# Altium project M1-Test-Board.PrjPcb (part 1 of 2)
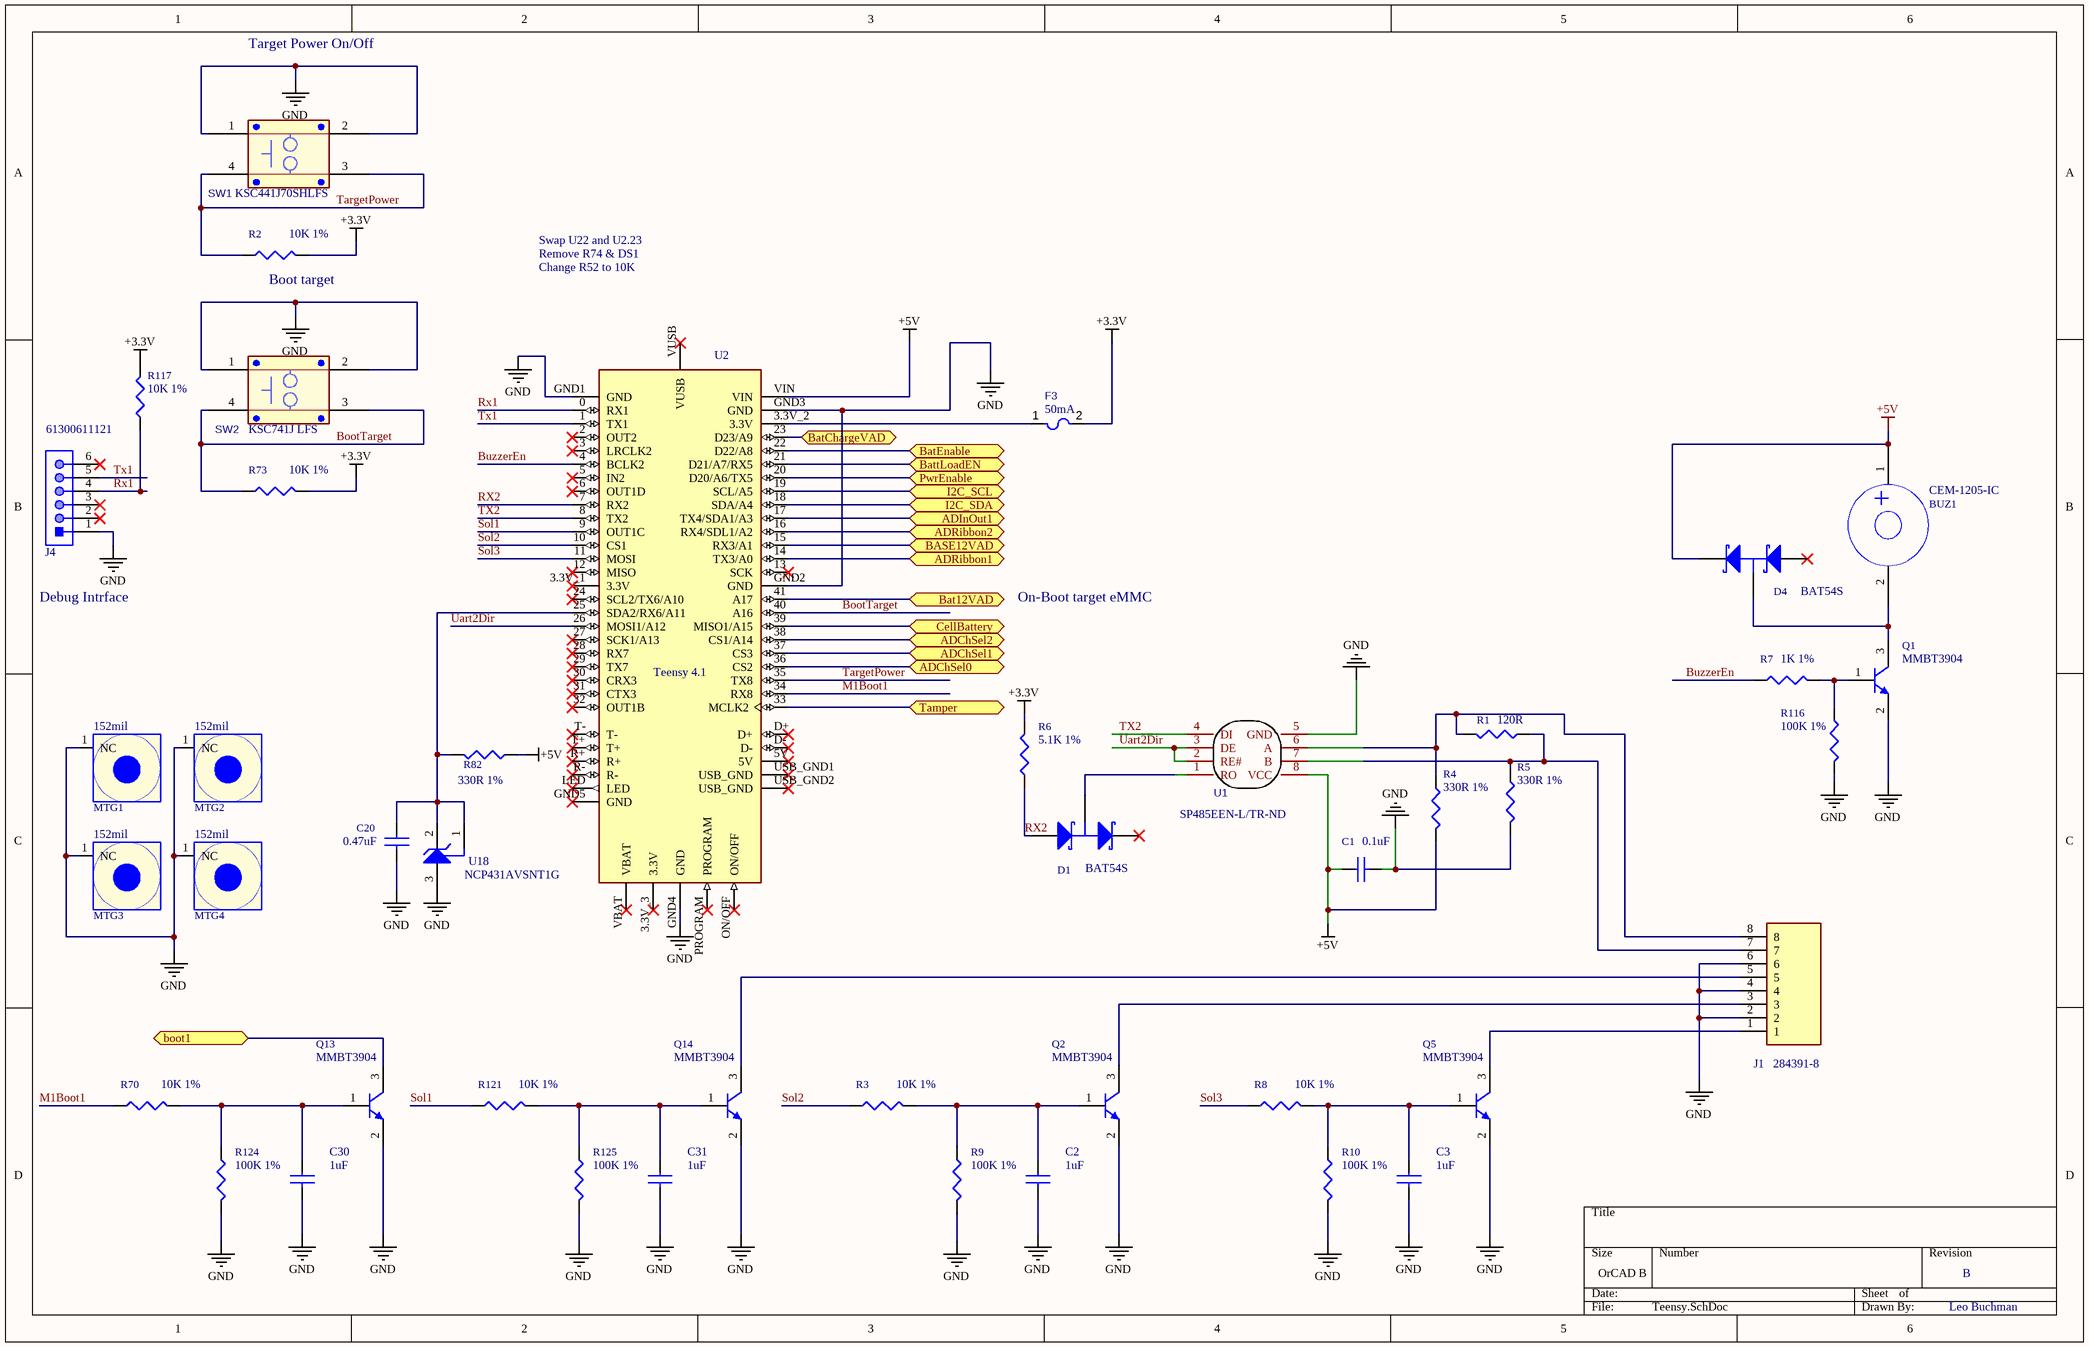
[diagram p0: Teensy.SchDoc]
3 sheets, 145 parts. Net scope: flat (ports and power ports of the same name join across sheets).
Board file: M1-Test-Board.PcbDoc
Sheets:
  Teensy.SchDoc
  RibbonCable.SchDoc
  InputOutput.SchDoc

## Sheet Teensy.SchDoc: M1 Test Fixture Custom Board
size OrCAD B; Author: Leo Buchman; Revision: B; SheetNumber: 1; SheetTotal: 4

### Parts
BUZ1  CEM-1205-IC  [BUZZ-MB5120C]
C1  0.1uF  [C0402]
C2  1uF  [C0402]
C3  1uF  [C0402]
C20  0.47uF  [C0402]
C30  1uF  [C0402]
C31  1uF  [C0402]
D1  BAT54S  [sot23-3]
D4  BAT54S  [sot23-3]
F3  50mA  [F0603]
J1  284391-8  [TE_284391-8]
J4  61300611121  [61300611121]
MTG1  152mil  [MNT-HOLE-169-350]  (no BOM)
MTG2  152mil  [MNT-HOLE-169-350]  (no BOM)
MTG3  152mil  [MNT-HOLE-169-350]  (no BOM)
MTG4  152mil  [MNT-HOLE-169-350]  (no BOM)
Q1  MMBT3904  [sot23-3]
Q2  MMBT3904  [sot23-3]
Q5  MMBT3904  [sot23-3]
Q13  MMBT3904  [sot23-3]
Q14  MMBT3904  [sot23-3]
R1  120R  [R0402]
R2  10K 1%  [R0402]
R3  10K 1%  [R0402]
R4  330R 1%  [R0402]
R5  330R 1%  [R0402]
R6  5.1K 1%  [R0402]
R7  1K 1%  [R0402]
R8  10K 1%  [R0402]
R9  100K 1%  [R0402]
R10  100K 1%  [R0402]
R70  10K 1%  [R0402]
R73  10K 1%  [R0402]
R82  330R 1%  [R0402]
R116  100K 1%  [R0402]
R117  10K 1%  [R0402]
R121  10K 1%  [R0402]
R124  100K 1%  [R0402]
R125  100K 1%  [R0402]
SW1  KSC441J70SHLFS  [SON4_KSC741JLFS_CNK-red]
SW2  KSC741J LFS  [SON4_KSC741JLFS_CNK-blue]
U1  SP485EEN-L/TR-ND  [NSOIC-8]
U2  Teensy 4.1  [MODULE_DEV-16771 - headers]
U18  NCP431AVSNT1G  [sot23-3]

### Ports
ADChSel0 (bidir), ADChSel1 (bidir), ADChSel2 (bidir), ADInOut1 (bidir), ADRibbon1 (bidir), ADRibbon2 (bidir), BASE12VAD (bidir), Bat12VAD (bidir), BatChargeVAD (bidir), BatEnable (bidir), BattLoadEN (bidir), boot1 (bidir), CellBattery (bidir), I2C_SCL (bidir), I2C_SDA (bidir), PwrEnable (bidir), Tamper (bidir)

### Nets
+3.3V: F3.2 R2.2 R6.2 R73.2 R117.2
+5V: BUZ1.1(POS) C1.1 D4.2(K) R4.2 R82.1 U1.8(VCC) U2.VIN
GND: C1.2 C2.2 C3.2 C20.2 C30.2 C31.2 J1.2 J1.4 J1.6 J4.1 MTG1.1(NC) MTG2.1(NC) MTG3.1(NC) MTG4.1(NC) Q1.2(E) Q2.2(E) Q5.2(E) Q13.2(E) Q14.2(E) R5.2 R9.2 R10.2 R116.2 R124.2 R125.2 SW1.1 SW1.2 SW2.1 SW2.2 U1.5(GND) U2.GND1(GND) U2.GND2(GND) U2.GND3(GND) U2.GND4(GND) U18.3(ANODE)
BootTarget: R73.1 SW2.3 SW2.4 U2.40(A16)
BuzzerEn: R7.1 U2.4(BCLK2)
M1Boot1: R70.1 U2.34(RX8)
Rx1: J4.4 R117.1 U2.0(RX1)
RX2: D1.1(A) R6.1 U2.7(RX2)
Sol1: R121.1 U2.9(OUT1C)
Sol2: R3.1 U2.10(CS1)
Sol3: R8.1 U2.11(MOSI)
TargetPower: R2.1 SW1.3 SW1.4 U2.35(TX8)
Tx1: J4.5 U2.1(TX1)
TX2: U1.4(DI) U2.8(TX2)
Uart2Dir: U1.2(RE#) U1.3(DE) U2.26(MOSI1/A12)
NetBUZ1_2: BUZ1.2(NEG) D4.3(C) Q1.3(C)
NetC2_1: C2.1 Q2.1(B) R3.2 R9.1
NetC3_1: C3.1 Q5.1(B) R8.2 R10.1
NetC20_1: C20.1 R82.2 U2.25(SDA2/RX6/A11) U18.1(REF) U18.2(CATHODE)
NetC30_1: C30.1 Q13.1(B) R70.2 R124.1
NetC31_1: C31.1 Q14.1(B) R121.2 R125.1
NetD1_3: D1.3(C) U1.1(RO)
NetF3_1: F3.1 U2.3.3V_2(3.3V)
NetJ1_1: J1.1 Q5.3(C)
NetJ1_3: J1.3 Q2.3(C)
NetJ1_5: J1.5 Q14.3(C)
NetJ1_7: J1.7 R1.1 R5.1 U1.7(B)
NetJ1_8: J1.8 R1.2 R4.1 U1.6(A)
NetJ5_3: U2.18(SDA/A4) ; port I2C_SDA
NetJ5_6: U2.19(SCL/A5) ; port I2C_SCL
NetJ6_8: Q13.3(C) ; port boot1
NetQ1_1: Q1.1(B) R7.2 R116.1
NetR71_2: U2.39(MISO1/A15) ; port CellBattery
NetR85_1: U2.33(MCLK2) ; port Tamper
NetR118_1: U2.14(TX3/A0) ; port ADRibbon1
NetR119_1: U2.16(RX4/SDL1/A2) ; port ADRibbon2
NetR120_1: U2.17(TX4/SDA1/A3) ; port ADInOut1
NetU2_15: U2.15(RX3/A1) ; port BASE12VAD
NetU2_20: U2.20(D20/A6/TX5) ; port PwrEnable
NetU2_21: U2.21(D21/A7/RX5) ; port BattLoadEN
NetU2_22: U2.22(D22/A8) ; port BatEnable
NetU2_23: U2.23(D23/A9) ; port BatChargeVAD
NetU2_36: U2.36(CS2) ; port ADChSel0
NetU2_37: U2.37(CS3) ; port ADChSel1
NetU2_38: U2.38(CS1/A14) ; port ADChSel2
NetU2_41: U2.41(A17) ; port Bat12VAD

Not connected (* = marked no-connect by the designer): D1 2(K)*; D4 1(A)*; J4 2* 3* 6*; U2 2(OUT2)* 3(LRCLK2)* 3.3V_1(3.3V)* 3.3V_3(3.3V)* 5(IN2)* 5V* 6(OUT1D)* 12(MISO)* 13(SCK)* 24(SCL2/TX6/A10)* 27(SCK1/A13)* 28(RX7)* 29(TX7)* 30(CRX3)* 31(CTX3)* 32(OUT1B)* D+* D-* GND5(GND)* LED* ON/OFF* PROGRAM* R+* R-* T+* T-* USB_GND1(USB_GND)* USB_GND2(USB_GND)* VBAT* VUSB*

### Notes on the sheet
- Target Power On/Off
- (near R2) Boot target
- Swap U22 and U2.23
- Remove R74 & DS1
- Change R52 to 10K
- Debug Intrface
- On-Boot target eMMC

### Library data of the parts
BUZ1 = Mod-0003: 12 mm, 5 Vdc, 92 dB, Through Hole, Driving Circuit, Magnetic Audio Indicator Buzzer; ADI Part Number: 3716-0001; Manufacturer: CUI Devices; Voltage: 5V; Current: 35mA; CLASS: DISCRETE; COMPSIDE: TOP; COMPLOC: [1301.000,1659.000]; COMPROT: 180; COMPGROUP: 0; COMPFIXED: NO; COMPHEIGHT: 0.000; S2 PN: S2-BZ-0001; COMPLOCKED: NO; COMPKEY: NO; DECOUPLER: NO; JLCPCB_PART: NA; S2PN: S2-BZ-0001; PCB Footprint: BUZZ-MB5120C; Part Name: Mod-0003; Supplier 1: Mouser; Supplier Part Number 1: 490-CEM1205IC; Manufacturer Part Number: CEM-1205-IC; RoHS: Yes; Category: Buzzers; Stock 1: 774; Pricing 1: 1=1.87000, 10=1.55000, 50=1.35000, 100=1.2700; Mount: Through Hole; LCSC Part Number: N/A
C1 = Cap-00005: Cap Ceramic 0.1uF 50V X7R 10% Pad SMD 0402 125C Automotive T/R; Manufacturer: Murata; Manufacturer Part Number: GRT155R71H104KE01D; Part Name: Cap-00005; Supplier 1: Digi-Key; Supplier Part Number 1: 490-GRT155R71H104KE01DCT-ND; RoHS: Yes; Category: Ceramic Capacitors; Stock 1: 179948; Pricing 1: 1=0.10000, 10=0.04700, 50=0.02580, 100=0.0211; Mount: Surface Mount; Case/Package: 0402; Case Code (Metric): 1005; Case Code (Imperial): 0402; RoHS Compliant: Yes; LCSC Part Number: C307331; Number of Pins: 2; Dielectric Material: Ceramic; Termination: SMD/SMT; Voltage Rating (DC): 50V
C2 C3 C30 C31 = Cap-00003: CAP CER 1UF 10V Y5V 0402; Manufacturer: KEMET; Manufacturer Part Number: C0402C105Z8VAC7867; Tolerance: 80%; Dielectric Material: Ceramic; Part Name: Cap-00003; Supplier 1: Digi-Key; Supplier Part Number 1: 399-14873-1-ND; RoHS: Yes; Category: Ceramic Capacitors; Stock 1: 9702; Pricing 1: 1=0.28000, 10=0.18900, 50=0.12580, 100=0.1070; Mount: Surface Mount; Case/Package: 0402; Case Code (Metric): 1005; Case Code (Imperial): 0402; Min Operating Temperature: -30°C; Max Operating Temperature: 85°C; Packaging: Cut Tape; Capacitance: 1uF; Voltage Rating: 10V; ComponentLink1URL: https://api.kemet.com/component-edge/download; ComponentLink1Description: https://api.kemet.com/component-edge/download; LCSC Part Number: C52923; Number of Pins: 2; Termination: SMD/SMT
C20 = Cap-00006: CAP CER 0.47UF 16V Y5V 0402; Manufacturer: Yageo; Manufacturer Part Number: CC0402ZRY5V7BB474; Tolerance: 80%; Capacitance: 470nF; Dielectric Material: Ceramic; Part Name: Cap-00006; Supplier 1: Digi-Key; Supplier Part Number 1: 311-1735-1-ND; RoHS: Yes; Category: Ceramic Capacitors; Stock 1: 154263; Pricing 1: 1=0.10000, 10=0.07700, 50=0.04180, 100=0.0342; Mount: Surface Mount; Case/Package: 0402; Case Code (Metric): 1005; Case Code (Imperial): 0402; Min Operating Temperature: -30°C; Max Operating Temperature: 85°C; Packaging: Tape and Reel; Voltage Rating: 16V; Dielectric: Y5V; Series: CC; Length: 1mm; Width: 0.02inch; Thickness: 0.022inch; Depth: 0.5mm; Radiation Hardening: No; RoHS Compliant: Yes; ComponentLink1URL: https://datasheet.ciiva.com/26862/getdatashee; ComponentLink1Description: https://datasheet.ciiva.com/26862/getdatashee; LCSC Part Number: C527993; Termination: SMD/SMT; Lead Free: Lead Free; Halogen Free: Halogen Free; Voltage Rating (DC): 16V; Weight: 2.3E-05oz; Resistor Type: Ceramic
D1 D4 = Diode-0009: DIODE SCHOTTKY 30V 150MA SOT23-3; Manufacturer: Sangdest Microelectronics; Manufacturer: ON Semiconductor / Fairchild; Recovery Time: 5ns; Package Version: Rev. 12, 03/2016; Peak Reverse Current: 2uA; Elements: 2; Package Reference: SOT23-3; Package URL: http://www.fairchildsemi.com/dwg/MA/MA03D.pdf; Pins: 3; Datasheet URL: https://www.fairchildsemi.com/datasheets/BA/BAT54S.pdf; Manufacturer URL: https://www.fairchildsemi.com/; Datasheet Version: Rev. 2.3, 04/2016; Mounting Technology: SM; Package Description: 3-Pin Small Outline Transistor, Body 2.92 x 1.325 mm, Pitch 0.95 mm; Manufacturer Part Number: BAT54S; Component Type: Diodes; Part Name: Diode-0009; Supplier 1: Digi-Key; Supplier Part Number 1: 1655-BAT54SCT-ND; RoHS: Yes; Stock 1: 168252; Pricing 1: 1=0.43000, 10=0.35100, 100=0.18620, 500=0.122; Mount: Surface Mount; Radiation Hardening: No; Lead Free: Lead Free; LCSC Part Number: C47546
F3 = FEMTOASMDC005F-2: Ptc Reset Fuse 15V 50MA 0603; Manufacturer: Littelfuse; Manufacturer: Bourns; Max Current Rating: 10A; Trip Current: 150mA; Time to Trip: 100ms; Case/Package: 0603; Package Reference: MF-MSMF050-2; Package Description: 2-Pin Surface Mount Device, Body 4.55 x 3.24 mm; Mounting Technology: SM; Datasheet Version: Rev. AG, 08/2016; Packaging: Cut Tape; Datasheet URL: http://www.bourns.com/data/global/pdfs/mfmsmf.pdf; Manufacturer Part Number: FEMTOASMDC005F-2; Component Type: Fuses; Part Name: FEMTOASMDC005F-2; Supplier 1: Digi-Key; Supplier Part Number 1: F9952CT-ND; RoHS: Yes; Category: PTC Resettable Fuses; Stock 1: 11749; Pricing 1: 1=0.90000, 5=0.87600, 10=0.82000, 50=0.67820,; Mount: Surface Mount; Case Code (Metric): 1608; Case Code (Imperial): 0603; Hold Current: 50mA; ComponentLink1URL: https://media.digikey.com/pdf/Data%20Sheets/L; ComponentLink1Description: https://media.digikey.com/pdf/Data%20Sheets/L; LCSC Part Number: C2832197
J1 = CON-0011: Conn Terminal Block F 8 POS 3.5mm Solder ST T; MF: TE Connectivity; MP: 284391-8; SnapEDA_Link: https://www.snapeda.com/parts/284391-8/TE%20Connectivity%20AMP%20Connectors/view-part/2375722/?ref=snap; EU_RoHS_Compliance: Compliant with Exemptions; Package: None; Digi-Key_Purchase_URL: https://www.digikey.com.au/product-detail/en/te-connectivity-amp-connectors/284391-8/A98163-ND/1827025?utm_source=snapeda&utm_medium=aggregator&utm_campaign=symbol; Value: *; TE_purchase_URL: https://www.te.com/usa-en/product-284391-8.html?te_bu=Cor&te_type=disp&te_campaign=seda_glo_cor-seda-global-disp-prtnr-fy19-seda-model-bom-cta_sma-317_1&elqCampaignId=32493; Digi-Key_Part_Number: A98163-ND; Part Name: CON-0011; Supplier 1: Mouser; Supplier Part Number 1: 571-284391-8; Manufacturer: TE Connectivity; Manufacturer Part Number: 284391-8; RoHS: Yes; Stock 1: 530; Pricing 1: 1=5.54000, 10=3.52000, 50=3.52000, 100=3.4300; LCSC Part Number: N/A; Category: Terminal Blocks; Mount: Through Hole; Color: Green; Contact Material: Brass; Contact Plating: Tin
J4 = CON-0003: CONN HEADER 6 POS 2.54; Manufacturer: Wurth Electronics; Part Name: CON-0003; Supplier 1: Digi-Key; Supplier Part Number 1: 732-5319-ND; Manufacturer Part Number: 61300611121; RoHS: Yes; Stock 1: 57047; Pricing 1: 1=0.35000, 10=0.29800, 25=0.24720, 50=0.20700; LCSC Part Number: C2833331; Category: Headers and Wire Housings; Mount: Through Hole; Color: Black; Contact Material: Copper Alloy,Copper; Contact Plating: Gold; Housing Material: PBT; Min Operating Temperature: -40°C; Max Operating Temperature: 125°C; Number of Rows: 1
MTG1-MTG4 = Hole-001: Plated; Part Name: Hole-001
Q1 Q2 Q5 Q13 Q14 = Tran-0002: Trans GP BJT NPN 60V 0.2A 350mW Automotive 3-Pin SOT-23 T/R; Manufacturer: ON Semiconductor / Fairchild; Manufacturer: ON Semiconductor; Elements: 1; Power: 225mW; Frequency: 250MHz; Vce Max: 300mV; Max Collector Current: 200mA; Collector-emitter Voltage-Max: 400mV; Mounting Technology: SM; Min Operating Temperature: -55°C; Datasheet URL: http://www.onsemi.cn/pub_link/Collateral/MMBT3904LT1-D.PDF; Pins: 3; Package Description: 3-Pin Small Outline Transistor, Body 2.9 x 1.3 mm, Pitch 0.95 mm; Max Operating Temperature: 150°C; Package Reference: SOT-23 (318-08); RoHS Compliant: Yes; Datasheet Version: Rev. 12, 11/2012; Case/Package: SOT-23-3; Manufacturer Part Number: MMBT3904; Component Type: Transistors; Part Name: Tran-0002; LCSC Part Number: C20526; Supplier 1: Newark; Supplier Part Number 1: 58K9431; RoHS: Yes; Mount: Surface Mount; ComponentLink1URL: https://datasheet.ciiva.com/22664/1708270-226; ComponentLink1Description: https://datasheet.ciiva.com/22664/1708270-226; Polarity: NPN; Number of Elements: 1; Max Frequency: 250MHz; Length: 2.9mm; Width: 1.3mm; Height: 0.94mm; Radiation Hardening: No; Lead Free: Lead Free; REACH SVHC: No SVHC; ComponentLink2URL: https://datasheet.ciiva.com/4721/mmbt3906lt1-; ComponentLink2Description: https://datasheet.ciiva.com/4721/mmbt3906lt1-; ComponentLink3URL: https://datasheet.ciiva.com/11201/mmbt3906lt1; ComponentLink3Description: https://datasheet.ciiva.com/11201/mmbt3906lt1; ComponentLink4URL: https://datasheet.ciiva.com/16387/mmbt3906lt1; ComponentLink4Description: https://datasheet.ciiva.com/16387/mmbt3906lt1; ComponentLink5URL: https://datasheet.ciiva.com/976/mmbt3906lt1-d; ComponentLink5Description: https://datasheet.ciiva.com/976/mmbt3906lt1-d; ComponentLink6URL: https://datasheet.ciiva.com/976/mmbt3906lt1-d; ComponentLink6Description: https://datasheet.ciiva.com/976/mmbt3906lt1-d; ComponentLink7URL: https://datasheet.ciiva.com/976/mmbt3906lt1-d; ComponentLink7Description: https://datasheet.ciiva.com/976/mmbt3906lt1-d; Series: -
R1 = Res-00013: Res Thick Film 0402 120 Ohm 1% 0.063W(1/16W) ±100ppm/C Pad SMD Automotive T/R; Manufacturer: Stackpole Electronics; Manufacturer Part Number: RMCF0402FT120R; Max Power Dissipation: 63mW; Temperature Coefficient: 100ppm/°C; Part Name: Res-00013; Supplier 1: Digi-Key; Supplier Part Number 1: RMCF0402FT120RCT-ND; RoHS: Yes; Category: Chip SMD Resistors; Stock 1: 195943; Pricing 1: 1=0.10000, 10=0.01500, 100=0.00610, 1000=0.00; Case/Package: 0402; Case Code (Metric): 1005; Case Code (Imperial): 0402; Min Operating Temperature: -55°C; Max Operating Temperature: 155°C; Packaging: Tape and Reel; Resistance: 120R; Resistor Type: Thick Film; Number of Terminations: 2; Tolerance: 1%; Features: Automotive AEC-Q200; Length: 0.039inch; Width: 0.02inch; Height: 0.016inch; RoHS Compliant: Yes; ComponentLink1URL: http://components.arrow.com/part/dataview/514; ComponentLink1Description: http://components.arrow.com/part/dataview/514; ComponentLink2URL: https://www.seielect.com/catalog/SEI-RMCF_RMC; ComponentLink2Description: https://www.seielect.com/catalog/SEI-RMCF_RMC; ComponentLink3URL: http://www.seielect.com/Catalog/SEI-RMCF_RMCP; ComponentLink3Description: http://www.seielect.com/Catalog/SEI-RMCF_RMCP; ComponentLink4URL: https://www.seielect.com/Catalog/SEI-RMCF_RMC; ComponentLink4Description: https://www.seielect.com/Catalog/SEI-RMCF_RMC; LCSC Part Number: C25079; Mount: Surface Mount; Contact Plating: Tin,Matte; Power Rating: 63mW; Series: RMCF; Radiation Hardening: No; Package Quantity: 10000; ComponentLink5URL: https://www.seielect.com/catalog/SEI-Packagin; ComponentLink5Description: https://www.seielect.com/catalog/SEI-Packagin
R2 R3 R8 R70 R73 R117 R121 = Res-00002: Thick Film 0402 10K OHM 1% 1/16W 0402; Manufacturer: Yageo; Manufacturer Part Number: RC0402FR-0710KP; Max Power Dissipation: 63mW; Temperature Coefficient: 150ppm/°C; Power Rating: 62.5mW; Part Name: Res-00002; Supplier 1: Digi-Key; Supplier Part Number 1: YAG1249CT-ND; RoHS: Yes; Category: Chip SMD Resistors; Stock 1: 161500; Pricing 1: 1=0.10000, 10=0.03600, 100=0.01450, 1000=0.00; Case/Package: 0402; Case Code (Metric): 1005; Case Code (Imperial): 0402; Min Operating Temperature: -55°C; Max Operating Temperature: 155°C; Packaging: Tape and Reel; Resistance: 10k; Resistor Type: Thick Film; Number of Terminations: 2; Tolerance: 1%; Features: Moisture Resistant; Length: 0.039inch; Width: 0.02inch; Height: 0.016inch; RoHS Compliant: Yes; ComponentLink1URL: http://www.yageo.com/NewPortal/yageodocoutput; ComponentLink1Description: http://www.yageo.com/NewPortal/yageodocoutput; LCSC Part Number: C25744; Mount: Surface Mount
R4 R5 R82 = Res-00009: Thick Film 0402 330 Ohm 1% 1/16W ±100ppm/°C Molded SMD Paper T/R; Manufacturer: Yageo; Manufacturer Part Number: AF0402FR-07330RL; Max Power Dissipation: 63mW; Power Rating: 62.5mW; Part Name: Res-00009; Supplier 1: Digi-Key; Supplier Part Number 1: 13-AF0402FR-07330RLCT-ND; RoHS: Yes; Category: Chip SMD Resistors; Stock 1: 15948; Pricing 1: 1=0.10000, 10=0.05800, 100=0.02360, 1000=0.01; Case/Package: 0402; Case Code (Metric): 1005; Case Code (Imperial): 0402; Min Operating Temperature: -55°C; Max Operating Temperature: 155°C; Packaging: Tape and Reel; Resistance: 330R; Resistor Type: Thick Film; Number of Terminations: 2; Tolerance: 1%; Temperature Coefficient: 100ppm/°C; Features: Moisture Resistant,Anti-Sulfur; Length: 0.039inch; Width: 0.02inch; Height: 0.015inch; RoHS Compliant: Yes; ComponentLink1URL: http://www.yageo.com/documents/recent/PYu-AF_; ComponentLink1Description: http://www.yageo.com/documents/recent/PYu-AF_; LCSC Part Number: C12246; Mount: Surface Mount; Radiation Hardening: No
R6 = Res-00004: Thick Film 0402 5.1K Ohm 1% 1/16W 0402; Manufacturer: Stackpole Electronics; Manufacturer Part Number: RMCF0402FT5K10; Max Power Dissipation: 63mW; Temperature Coefficient: 100ppm/°C; Power Rating: 62.5mW; Part Name: Res-00004; Supplier 1: Digi-Key; Supplier Part Number 1: RMCF0402FT5K10CT-ND; RoHS: Yes; Category: Chip SMD Resistors; Stock 1: 131490; Pricing 1: 1=0.10000, 10=0.01500, 100=0.00610, 1000=0.00; Case/Package: 0402; Case Code (Metric): 1005; Case Code (Imperial): 0402; Min Operating Temperature: -55°C; Max Operating Temperature: 155°C; Packaging: Tape and Reel; Resistance: 5.1k; Resistor Type: Thick Film; Number of Terminations: 2; Tolerance: 1%; Features: Automotive AEC-Q200; Length: 0.039inch; Width: 0.02inch; Height: 0.016inch; RoHS Compliant: Yes; ComponentLink1URL: http://components.arrow.com/part/dataview/513; ComponentLink1Description: http://components.arrow.com/part/dataview/513; ComponentLink2URL: https://www.seielect.com/catalog/SEI-RMCF_RMC; ComponentLink2Description: https://www.seielect.com/catalog/SEI-RMCF_RMC; ComponentLink3URL: https://www.seielect.com/catalog/SEI-Packagin; ComponentLink3Description: https://www.seielect.com/catalog/SEI-Packagin; ComponentLink4URL: https://datasheet.ciiva.com/15193/getdatashee; ComponentLink4Description: https://datasheet.ciiva.com/15193/getdatashee; LCSC Part Number: C25905; Mount: Surface Mount; Contact Plating: Tin,Matte; Series: RMCF; Radiation Hardening: No; Size Code: 0402; Construction: Rectangular; Depth: 0.5mm; Military Standard: Not; Lead Free: Lead Free
R7 = Res-00001: Thick Film 0402 1K Ohm 1% 1/8W 0402; Manufacturer: TE Connectivity; Manufacturer Part Number: CRGP0402F1K0; Max Power Dissipation: 125mW; Temperature Coefficient: 100ppm/°C; Power Rating: 0.125W; Part Name: Res-00001; Supplier 1: Digi-Key; Supplier Part Number 1: A130355CT-ND; RoHS: Yes; Category: Chip SMD Resistors; Stock 1: 16450; Pricing 1: 1=0.12000, 10=0.11100, 100=0.04270, 1000=0.01; Case/Package: 0402; Case Code (Metric): 1005; Case Code (Imperial): 0402; Min Operating Temperature: -55°C; Max Operating Temperature: 155°C; Packaging: Tape and Reel; Resistance: 1k; Resistor Type: Thick Film; Number of Terminations: 2; Tolerance: 1%; RoHS Compliant: Yes; ComponentLink1URL: https://www.te.com/commerce/DocumentDelivery/; ComponentLink1Description: https://www.te.com/commerce/DocumentDelivery/; ComponentLink4Description: none; LCSC Part Number: C21190; Mount: Surface Mount
R9 R10 R116 R124 R125 = Res-00003: Thick Film 0402 100K OHM 1% 1/16W 0402; Manufacturer: Stackpole Electronics; Manufacturer Part Number: RMCF0402FT100K; Power Rating: 62.5mW; Part Name: Res-00003; Supplier 1: Digi-Key; Supplier Part Number 1: RMCF0402FT100KCT-ND; RoHS: Yes; Category: Chip SMD Resistors; Stock 1: 13703190; Pricing 1: 1=0.10000, 10=0.01500, 100=0.00610, 1000=0.00; Case/Package: 0402; Case Code (Metric): 1005; Case Code (Imperial): 0402; LCSC Part Number: C25741; Mount: Surface Mount; Contact Plating: Tin,Matte
SW1 = SW-0002: Switch Tactile N.O. SPST Round Button J-Bend; Manufacturer: ITT C&K; Actuator Material: Nylon,Polyamide,PA66; Mechanical Life: 300000Cycles; Operating Force: 5N; Max Current Rating: 50mA; Voltage Rating (DC): 32V; Illumination Type: Non-Illuminated,Illuminated; Switch Function: Off-Mom; Actuator Type: Standard; Switch Travel: 0.75mm; Actuator Length: 2.6mm; Power Rating: 1W; Part Name: SW-0002; LCSC Part Number: C221748; Supplier 1: Digi-Key; Supplier Part Number 1: 401-1784-1-ND; Manufacturer Part Number: KSC441J70SHLFS; RoHS: Yes; Category: Tactile Switches; Stock 1: 60296; Pricing 1: 1=0.61000, 10=0.58400, 25=0.56200, 100=0.4863; Mount: Surface Mount; Case/Package: SMD/SMT; Contact Material: Silver; Contact Plating: Silver; Min Operating Temperature: -40°C; Max Operating Temperature: 85°C; Packaging: Tape and Reel; Throw Configuration: SPST; Max Voltage Rating (DC): 32V; Termination: J-Bend; Orientation: Straight; Contact Current Rating: 50mA; Package Quantity: 1; Current Rating: 50mA; Series: KSC; Length: 6.2mm; Depth: 6.8mm; REACH SVHC: No SVHC; Lead Free: Lead Free; ComponentLink1URL: https://datasheet.ciiva.com/29903/getdatashee; ComponentLink1Description: https://datasheet.ciiva.com/29903/getdatashee; ComponentLink2URL: https://datasheet.ciiva.com/14920/pts645-1492; ComponentLink2Description: https://datasheet.ciiva.com/14920/pts645-1492; ComponentLink3URL: https://datasheet.ciiva.com/22637/1707731-226; ComponentLink3Description: https://datasheet.ciiva.com/22637/1707731-226; Color: Black
SW2 = SW-0001: Switch Tactile N.O. SPST Round Button J-Bend; Manufacturer: ITT C&K; Mechanical Life: 300000Cycles; Actuator Color: Blue; Operating Force: 4N; Max Current Rating: 50mA; Voltage Rating (DC): 32V; Illumination Type: Non-Illuminated; Switch Function: Off-Mom; Actuator Type: Standard; Switch Travel: 0.4mm; Actuator Length: 1.7mm; Power Rating: 1W; Ratings: IP67,Waterproof,Dust Tight; Part Name: SW-0001; LCSC Part Number: C221766; Supplier 1: Digi-Key; Supplier Part Number 1: CKN10309CT-ND; Manufacturer Part Number: KSC741JLFS; RoHS: Yes; Category: Tactile Switches; Stock 1: 157978; Pricing 1: 1=0.59000, 10=0.56600, 25=0.54520, 100=0.4719; Mount: Surface Mount; Case/Package: SMD/SMT; Contact Material: Silver; Contact Plating: Silver; Min Operating Temperature: -40°C; Max Operating Temperature: 85°C; Packaging: Tape and Reel; Throw Configuration: SPST; Max Voltage Rating (DC): 32V; Termination: J-Bend; Orientation: Straight; Package Quantity: 1000; Current Rating: 50mA; Series: KSC; Length: 6.2mm; Depth: 6.8mm; Radiation Hardening: No; REACH SVHC: No SVHC; Lead Free: Lead Free; RoHS Compliant: Yes; ComponentLink1URL: https://datasheet.ciiva.com/16458/ksc741jlfs-; ComponentLink1Description: https://datasheet.ciiva.com/16458/ksc741jlfs-; ComponentLink2URL: https://datasheet.ciiva.com/2900/ksc-2900326.; ComponentLink2Description: https://datasheet.ciiva.com/2900/ksc-2900326.; ComponentLink3URL: https://datasheet.ciiva.com/2900/ksc-2900327.; ComponentLink3Description: https://datasheet.ciiva.com/2900/ksc-2900327.; ComponentLink4URL: https://datasheet.ciiva.com/2900/ksc-2900328.; ComponentLink4Description: https://datasheet.ciiva.com/2900/ksc-2900328.; ComponentLink5URL: https://datasheet.ciiva.com/22829/0900766b80a; ComponentLink5Description: https://datasheet.ciiva.com/22829/0900766b80a; ComponentLink6URL: https://datasheet.ciiva.com/16298/ksc441j70sh; ComponentLink6Description: https://datasheet.ciiva.com/16298/ksc441j70sh; ComponentLink7URL: https://datasheet.ciiva.com/18144/ksc-22jan15; ComponentLink7Description: https://datasheet.ciiva.com/18144/ksc-22jan15; ComponentLink8URL: https://datasheet.ciiva.com/2900/ksc-2900355.; ComponentLink8Description: https://datasheet.ciiva.com/2900/ksc-2900355.; Size: 6.2mm; ComponentLink9URL: https://datasheet.ciiva.com/2900/ksc-2900356.; ComponentLink9Description: https://datasheet.ciiva.com/2900/ksc-2900356.; ComponentLink10URL: https://datasheet.ciiva.com/2900/ksc-2900357.; ComponentLink10Description: https://datasheet.ciiva.com/2900/ksc-2900357.; ComponentLink11URL: https://datasheet.ciiva.com/16155/ksc-11mar10; ComponentLink11Description: https://datasheet.ciiva.com/16155/ksc-11mar10
U1 = dd-0001: IC TXRX RS485 HALF DUPLEX 8SOIC; BOM_Manufacturer: EXAR; Package Display: No; Data Rate: 10Mbps; Nominal Supply Current: 900uA; Max Power Dissipation: 550mW; Operating Supply Voltage: 5V; Number of Receivers: 1; Min Supply Voltage: 4.75V; Max Supply Voltage: 5.25V; Logic Function: Transceiver; Interface: RS-422,RS-485; BOM_Supplier: LCSC; BOM_Manufacturer Part: SP485EEN-L/TR; BOM_Supplier Part: C6855; BOM_JLCPCB Part Class: Basic Part; spicePre: U; spiceSymbolName: SP485EEN-L/TR; Part Name: dd-0001; LCSC Part Number: C6855; Supplier 1: Digi-Key; Supplier Part Number 1: SP485EEN-L/TR-ND; Manufacturer: Exar; Manufacturer Part Number: SP485EEN-L/TR; RoHS: Yes; Category: Interface ICs; Mount: Surface Mount; Case/Package: SOIC; Number of Pins: 8; Min Operating Temperature: -40°C; Max Operating Temperature: 85°C; Packaging: Tape and Reel; Simplex/Duplex: Half Duplex; Package Quantity: 2500; Number of Transmitters: 1; Number of Drivers: 1; Number of Transceivers: 1; Length: 4.9mm; Width: 3.9mm; Height: 1.65mm; Radiation Hardening: No; RoHS Compliant: Yes; Lead Free: Lead Free; ComponentLink1URL: https://datasheet.ciiva.com/16991/0900766b80d; ComponentLink1Description: https://datasheet.ciiva.com/16991/0900766b80d; ComponentLink2URL: https://datasheet.ciiva.com/6633/sp481e-485e-; ComponentLink2Description: https://datasheet.ciiva.com/6633/sp481e-485e-; ComponentLink3URL: https://datasheet.ciiva.com/6633/sp481e-485e-; ComponentLink3Description: https://datasheet.ciiva.com/6633/sp481e-485e-; ComponentLink4URL: https://datasheet.ciiva.com/6633/sp481e-485e-; ComponentLink4Description: https://datasheet.ciiva.com/6633/sp481e-485e-; ComponentLink5URL: https://datasheet.ciiva.com/16378/sp485een-l-; ComponentLink5Description: https://datasheet.ciiva.com/16378/sp485een-l-
U2 = Mod-0004: Teensy 4.1 Development Board; Manufacturer: SparkFun; Part Name: Mod-0004; Supplier 1: Digi-Key; Supplier Part Number 1: 1568-DEV-16771-ND; Manufacturer Part Number: DEV-16771; RoHS: No; Category: Embedded Processors and Controllers
U18 = AIC-0002: V-Ref Adjustable 2.5V to 36V 100mA 3-Pin SOT-; Manufacturer: ON Semiconductor; PartNumber: TL431ACLP; Manufacturer: Texas Instruments; VO Adj(Max)(V): 36; Initial Accuracy @ 25/deg C(%): 1; SubFamily: Shunt Voltage Reference; Temp Coeff(Typ)(ppm/ degree C): 34; VO Adj(Min)(V): 2.495; Rating: Catalog; Min Iz for Regulation(uA): 600; Temp Coeff(Max)(ppm/ degree C): 92; Iout/Iz(Max)(mA): 100; Eco-Plan: Pb-Free (RoHS); Max Input Voltage: 2.525V; Min Input Voltage: 2.475V; Tolerance: 1%; Temperature Coefficient: 50ppm/°C; Cathode Current: 60uA; Reference Type: Shunt,Adjustable,Programmable; Code_JEDEC: TO-226; PackageReference: LP0003A; ComponentLink1Description: https://datasheet.ciiva.com/8132/ncp431-d-813; ComponentLink2URL: https://datasheet.ciiva.com/30476/0900766b812; DatasheetVersion: SLVS543M; ComponentLink3Description: https://datasheet.ciiva.com/49020/70300496-49; Mounting Technology: Through Hole; PackageVersion: 4040001-2/C; ComponentLink2Description: https://datasheet.ciiva.com/30476/0900766b812; ComponentLink3URL: https://datasheet.ciiva.com/49020/70300496-49; PackageDescription: Plastic Cylindrical Package, Formed Lead Option (TO-92); ComponentLink1URL: https://datasheet.ciiva.com/8132/ncp431-d-813; Manufacturer Part Number: NCP431AVSNT1G; Part Name: AIC-0002; LCSC Part Number: C3113; Supplier 1: Digi-Key; Supplier Part Number 1: NCP431AVSNT1GOSCT-ND; RoHS: Yes; Category: Voltage References; Stock 1: 4510; Pricing 1: 1=0.44000, 10=0.35700, 25=0.32640, 100=0.2429; Case/Package: SOT-23-3; Number of Pins: 3; Min Operating Temperature: -40°C; Max Operating Temperature: 125°C; Package Quantity: 3000; Packaging: Tape and Reel; Series: -; Max Output Current: 100mA; Length: 3.04mm; Width: 1.4mm; Height: 1.01mm; Radiation Hardening: No; Lead Free: Lead Free; REACH SVHC: No SVHC; Output Current: 100mA; Output Voltage: 36V; Min Output Voltage: 2.5V; Max Output Voltage: 36V; Reference Voltage: 2.5V; Output Type: Adjustable; Halogen Free: Halogen Free

## Sheet RibbonCable.SchDoc: M1 Test Fixture Custom Board
size OrCAD B; Author: Leo Buchman; Revision: B; SheetNumber: 2; SheetTotal: 4
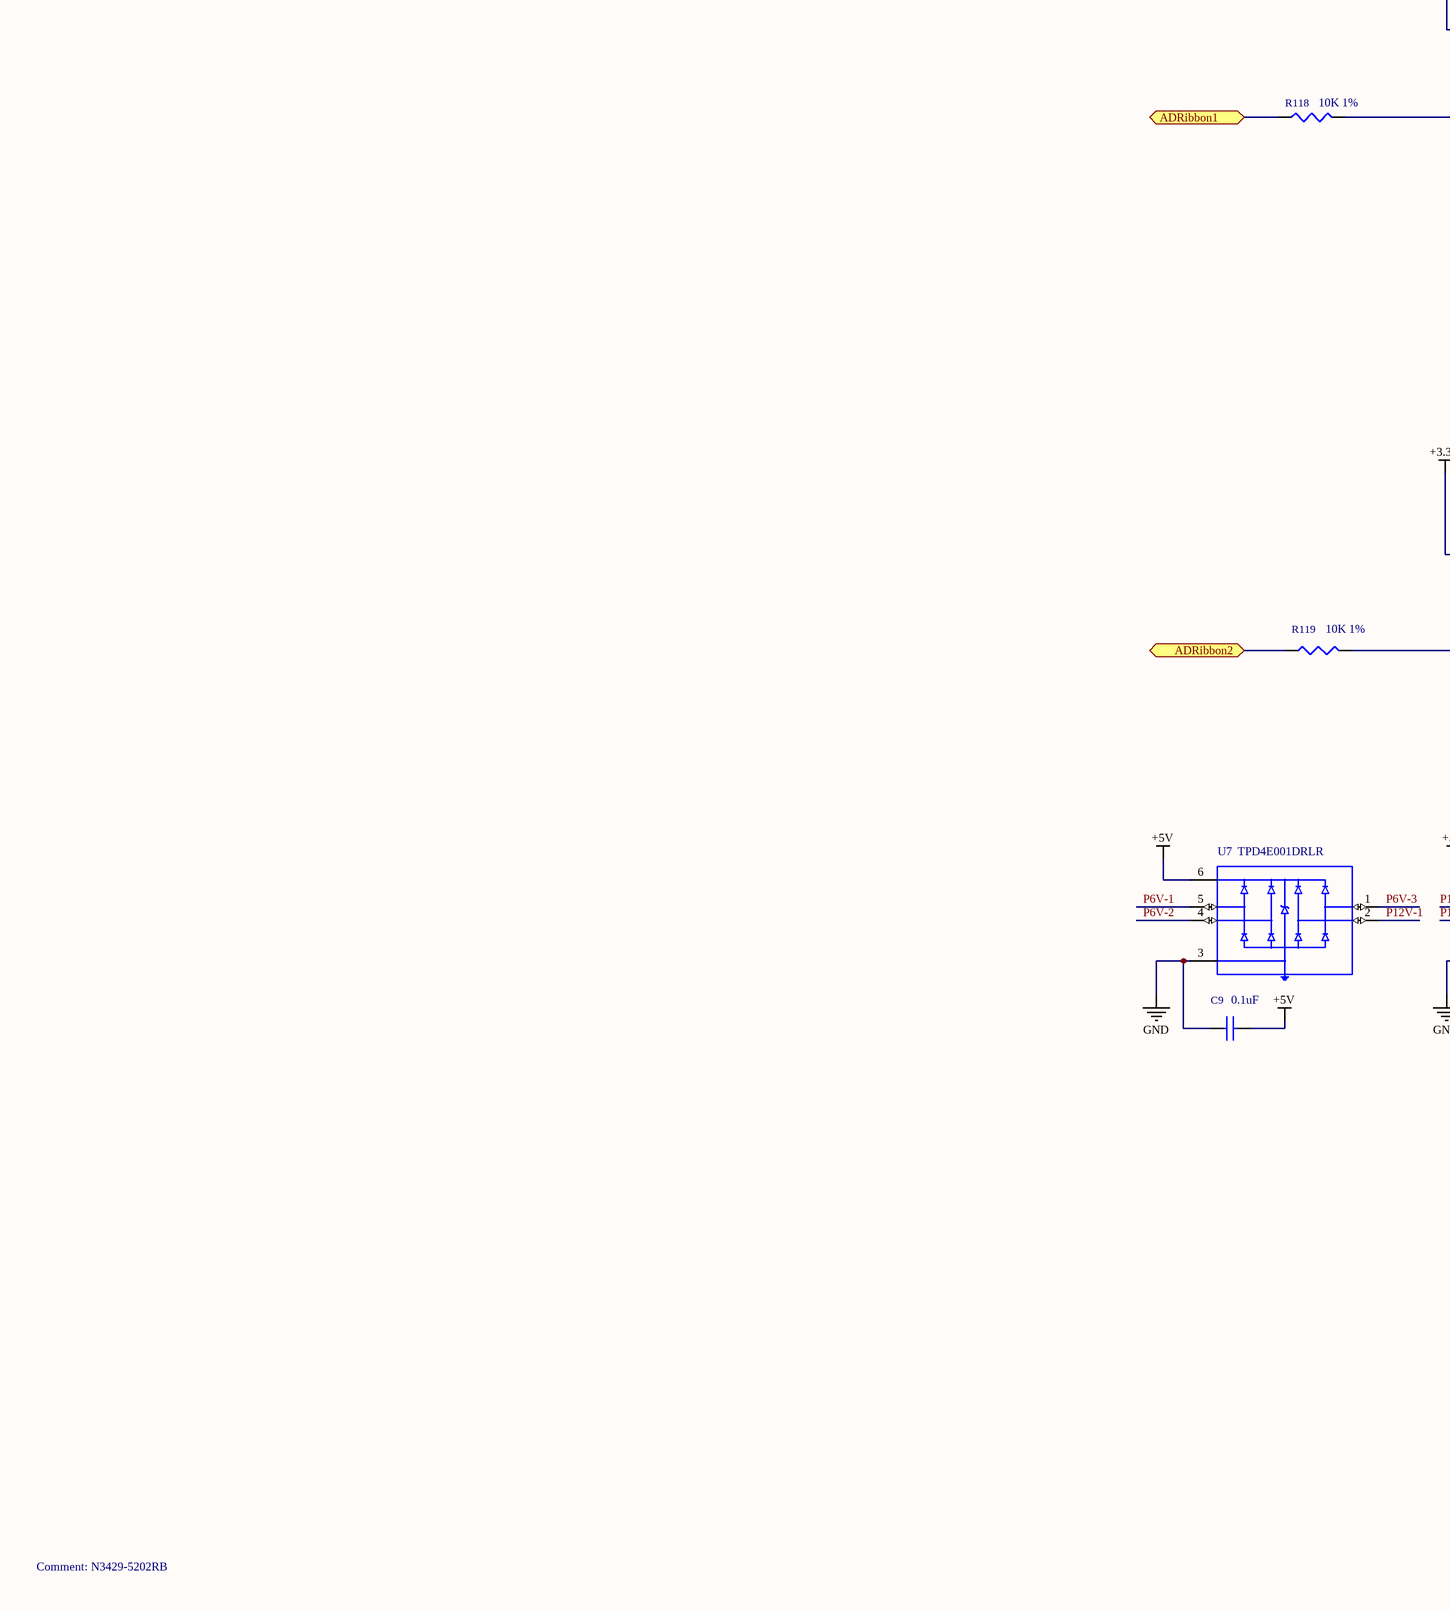
[diagram p1: RibbonCable.SchDoc, left]
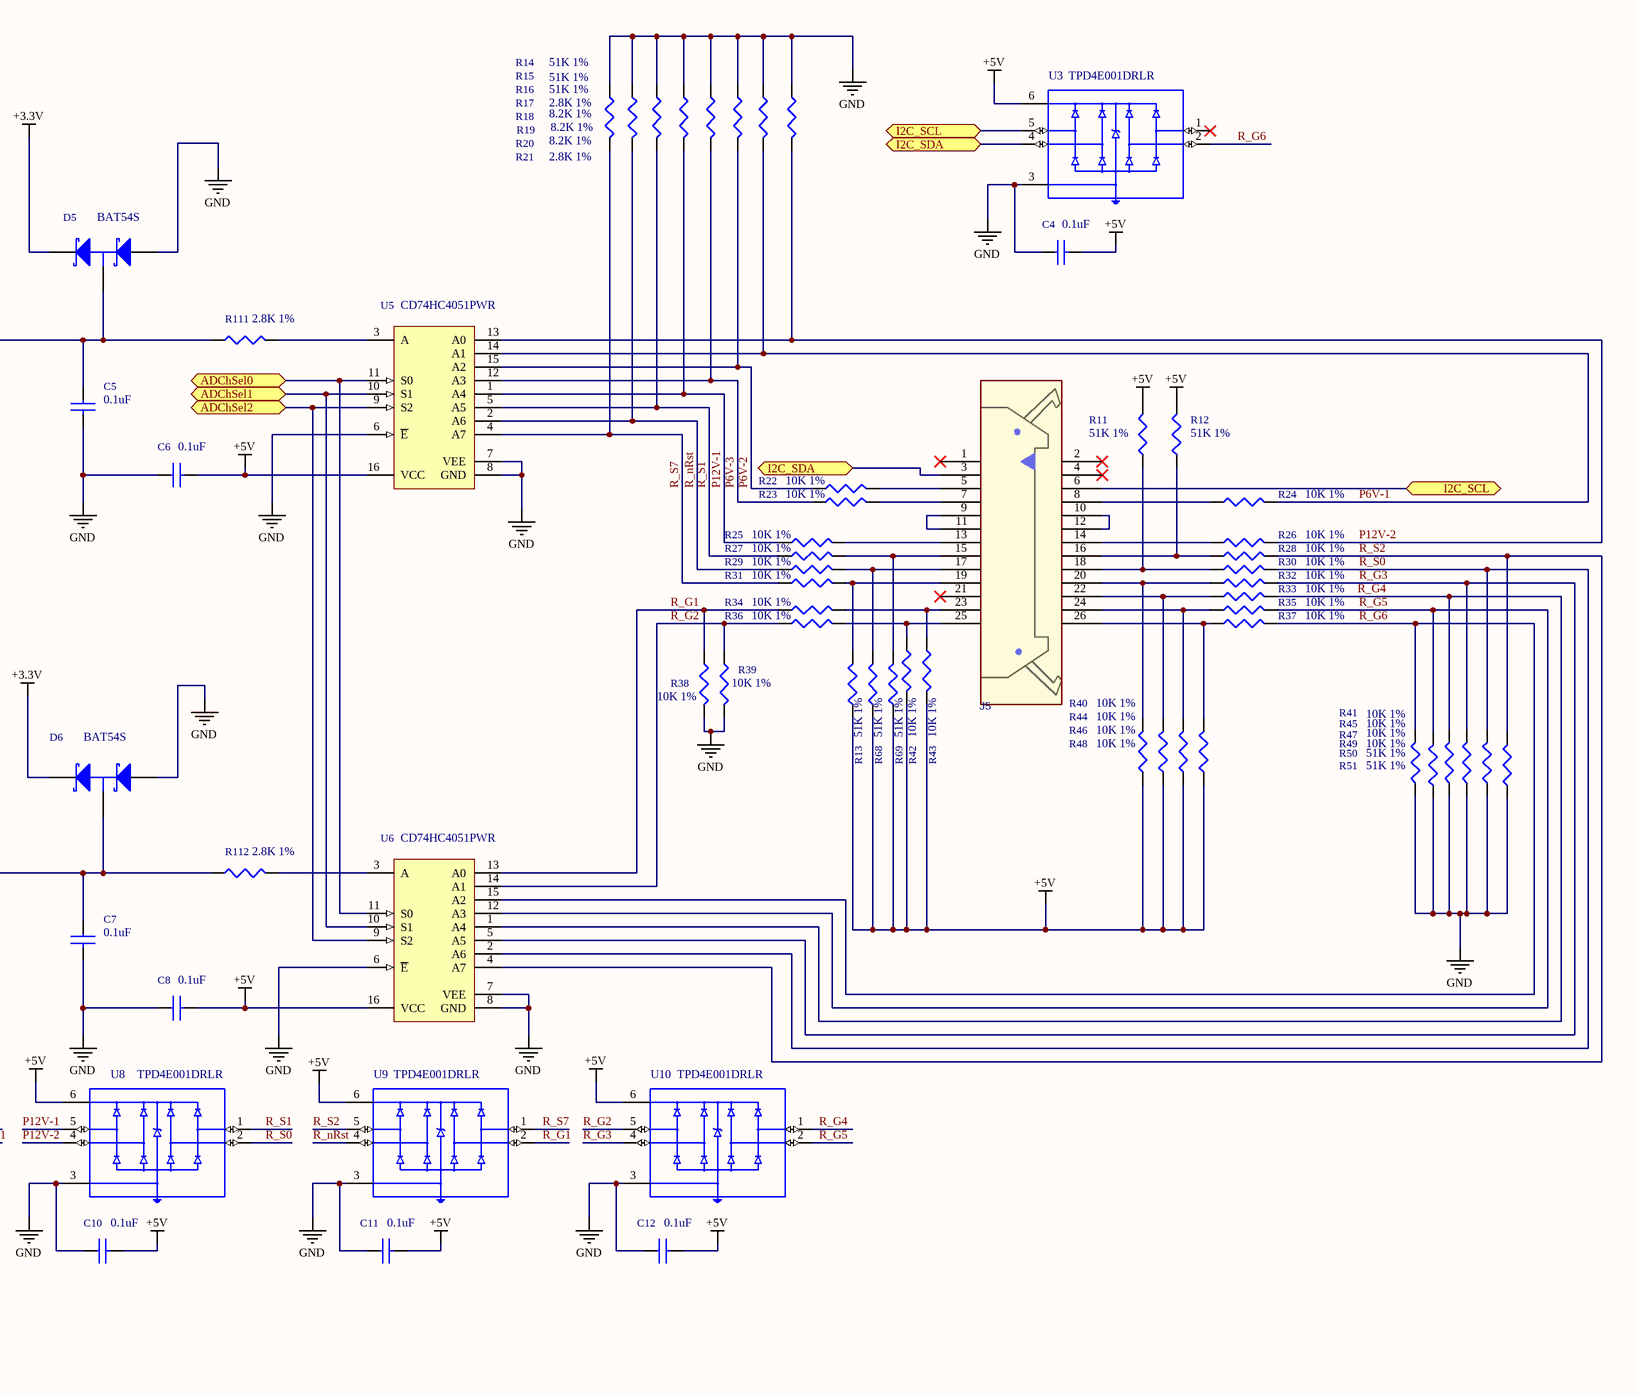
[diagram p2: RibbonCable.SchDoc, right]

### Parts
C4  0.1uF  [C0402]
C5  0.1uF  [C0402]
C6  0.1uF  [C0402]
C7  0.1uF  [C0402]
C8  0.1uF  [C0402]
C9  0.1uF  [C0402]
C10  0.1uF  [C0402]
C11  0.1uF  [C0402]
C12  0.1uF  [C0402]
D5  BAT54S  [sot23-3]
D6  BAT54S  [sot23-3]
J5  N3429-5202RB  [CONN_N3429-5202RB]
R11  51K 1%  [R0402]
R12  51K 1%  [R0402]
R13  51K 1%  [R0402]
R14  51K 1%  [R0402]
R15  51K 1%  [R0402]
R16  51K 1%  [R0402]
R17  2.8K 1%  [R0402]
R18  8.2K 1%  [R0402]
R19  8.2K 1%  [R0402]
R20  8.2K 1%  [R0402]
R21  2.8K 1%  [R0402]
R22  10K 1%  [R0402]
R23  10K 1%  [R0402]
R24  10K 1%  [R0402]
R25  10K 1%  [R0402]
R26  10K 1%  [R0402]
R27  10K 1%  [R0402]
R28  10K 1%  [R0402]
R29  10K 1%  [R0402]
R30  10K 1%  [R0402]
R31  10K 1%  [R0402]
R32  10K 1%  [R0402]
R33  10K 1%  [R0402]
R34  10K 1%  [R0402]
R35  10K 1%  [R0402]
R36  10K 1%  [R0402]
R37  10K 1%  [R0402]
R38  10K 1%  [R0402]
R39  10K 1%  [R0402]
R40  10K 1%  [R0402]
R41  10K 1%  [R0402]
R42  10K 1%  [R0402]
R43  10K 1%  [R0402]
R44  10K 1%  [R0402]
R45  10K 1%  [R0402]
R46  10K 1%  [R0402]
R47  10K 1%  [R0402]
R48  10K 1%  [R0402]
R49  10K 1%  [R0402]
R50  51K 1%  [R0402]
R51  51K 1%  [R0402]
R68  51K 1%  [R0402]
R69  51K 1%  [R0402]
R111  2.8K 1%  [R0402]
R112  2.8K 1%  [R0402]
R118  10K 1%  [R0402]
R119  10K 1%  [R0402]
U3  TPD4E001DRLR  [SOTFL50P160X60-6N]
U5  CD74HC4051PWR  [16-TSSOP-4.4mm]
U6  CD74HC4051PWR  [16-TSSOP-4.4mm]
U7  TPD4E001DRLR  [SOTFL50P160X60-6N]
U8  TPD4E001DRLR  [SOTFL50P160X60-6N]
U9  TPD4E001DRLR  [SOTFL50P160X60-6N]
U10  TPD4E001DRLR  [SOTFL50P160X60-6N]

### Ports
ADChSel0 (bidir), ADChSel1 (bidir), ADChSel2 (bidir), ADRibbon1 (bidir), ADRibbon2 (bidir), I2C_SCL (bidir), I2C_SDA (bidir)

### Nets
+3.3V: D5.2(K) D6.2(K)
+5V: C4.2 C6.2 C8.2 C9.2 C10.2 C11.2 C12.2 R11.2 R12.2 R13.1 R40.1 R42.2 R43.2 R44.1 R46.1 R48.1 R68.1 R69.1 U3.6(VCC) U5.16(VCC) U6.16(VCC) U7.6(VCC) U8.6(VCC) U9.6(VCC) U10.6(VCC)
GND: C4.1 C5.2 C6.1 C7.2 C8.1 C9.1 C10.1 C11.1 C12.1 D5.1(A) D6.1(A) R14.1 R15.1 R16.1 R17.1 R18.1 R19.1 R20.1 R21.1 R38.2 R39.2 R41.1 R45.1 R47.1 R49.1 R50.1 R51.1 U3.3(GND) U5.6(~{E}) U5.7(VEE) U5.8(GND) U6.6(~{E}) U6.7(VEE) U6.8(GND) U7.3(GND) U8.3(GND) U9.3(GND) U10.3(GND)
P6V-1: R20.2 R24.2 U5.14(A1) U7.5(IO4)
P6V-2: R19.2 R22.1 U5.15(A2) U7.4(IO3)
P6V-3: R18.2 R23.1 U5.12(A3) U7.1(IO1)
P12V-1: R17.2 R25.1 U5.1(A4) U7.2(IO2) U8.5(IO4)
P12V-2: R21.2 R26.2 U5.13(A0) U8.4(IO3)
R_G1: R34.1 R38.1 U6.13(A0) U9.2(IO2)
R_G2: R36.1 R39.1 U6.14(A1) U10.5(IO4)
R_G3: R32.2 R49.2 U6.5(A5) U10.4(IO3)
R_G4: R33.2 R47.2 U6.1(A4) U10.1(IO1)
R_G5: R35.2 R45.2 U6.12(A3) U10.2(IO2)
R_G6: R37.2 R41.2 U3.2(IO2) U6.15(A2)
R_nRst: R15.2 R29.1 U5.2(A6) U9.4(IO3)
R_S0: R30.2 R50.2 U6.2(A6) U8.2(IO2)
R_S1: R16.2 R27.1 U5.5(A5) U8.1(IO1)
R_S2: R28.2 R51.2 U6.4(A7) U9.5(IO4)
R_S7: R14.2 R31.1 U5.4(A7) U9.1(IO1)
NetC5_1: C5.1 D5.3(C) R111.1 R118.2
NetC7_1: C7.1 D6.3(C) R112.1 R119.2
NetJ5_3: J5.3 U3.4(IO3) ; port I2C_SDA
NetJ5_5: J5.5 R22.2
NetJ5_6: J5.6 U3.5(IO4) ; port I2C_SCL
NetJ5_7: J5.7 R23.2
NetJ5_8: J5.8 R24.1
NetJ5_9: J5.9 J5.11
NetJ5_10: J5.10 J5.12
NetJ5_13: J5.13 R25.2
NetJ5_14: J5.14 R26.1
NetJ5_15: J5.15 R27.2 R69.2
NetJ5_16: J5.16 R12.1 R28.1
NetJ5_17: J5.17 R29.2 R68.2
NetJ5_18: J5.18 R11.1 R30.1
NetJ5_19: J5.19 R13.2 R31.2
NetJ5_20: J5.20 R32.1 R40.2
NetJ5_22: J5.22 R33.1 R44.2
NetJ5_23: J5.23 R34.2 R43.1
NetJ5_24: J5.24 R35.1 R46.2
NetJ5_25: J5.25 R36.2 R42.1
NetJ5_26: J5.26 R37.1 R48.2
NetR111_2: R111.2 U5.3(A)
NetR112_2: R112.2 U6.3(A)
NetR118_1: R118.1 ; port ADRibbon1
NetR119_1: R119.1 ; port ADRibbon2
NetU2_36: U5.11(S0) U6.11(S0) ; port ADChSel0
NetU2_37: U5.10(S1) U6.10(S1) ; port ADChSel1
NetU2_38: U5.9(S2) U6.9(S2) ; port ADChSel2

Not connected (* = marked no-connect by the designer): J5 1* 2* 4* 21*; U3 1(IO1)*

### Library data of the parts
C4-C12 = Cap-00005: as C1 on sheet Teensy; Part Name: Cap-00005; Supplier 1: Digi-Key; Supplier Part Number 1: 490-GRT155R71H104KE01DCT-ND; RoHS: Yes; Category: Ceramic Capacitors; Stock 1: 179948; Pricing 1: 1=0.10000, 10=0.04700, 50=0.02580, 100=0.0211; Mount: Surface Mount; Case/Package: 0402; Case Code (Metric): 1005; Case Code (Imperial): 0402; RoHS Compliant: Yes; LCSC Part Number: C307331; Number of Pins: 2; Dielectric Material: Ceramic; Termination: SMD/SMT; Voltage Rating (DC): 50V
D5 D6 = Diode-0009: as D1 on sheet Teensy; Package Reference: SOT23-3; Package URL: http://www.fairchildsemi.com/dwg/MA/MA03D.pdf; Pins: 3; Datasheet URL: https://www.fairchildsemi.com/datasheets/BA/BAT54S.pdf; Manufacturer URL: https://www.fairchildsemi.com/; Datasheet Version: Rev. 2.3, 04/2016; Mounting Technology: SM; Package Description: 3-Pin Small Outline Transistor, Body 2.92 x 1.325 mm, Pitch 0.95 mm; Manufacturer Part Number: BAT54S; Component Type: Diodes; Part Name: Diode-0009; Supplier 1: Digi-Key; Supplier Part Number 1: 1655-BAT54SCT-ND; RoHS: Yes; Stock 1: 168252; Pricing 1: 1=0.43000, 10=0.35100, 100=0.18620, 500=0.122; Mount: Surface Mount; Radiation Hardening: No; Lead Free: Lead Free; LCSC Part Number: C47546
J5 = CON-0010: 3000 Series; 2.54mm Pitch 26 Way 2 Row Right; Manufacturer: 3M; ATTR: CONN HEADER LATCH/EJEC  RTA DUAL ROW 26POS; PKG: 2M54_13x2_TH_LATCH; Connector Type: Male Pin; Number of Positions: 26; Current Rating: 1A; Voltage Rating: 300V; Gender: Male; Number of Positions Per Level: 8; Number of Levels: 1; Max Current Rating: 2A; Current: 12A; Shrouded: Yes (With); Tail Length: 3.5mm; Wire Gauge (Max): 30AWG; Row Spacing: 0.1inch; Closed End: No (Without); Plating: Brass; Thread Size: M2; Part Name: CON-0010; Supplier 1: Digi-Key; Supplier Part Number 1: MHR26S-ND; Manufacturer Part Number: N3429-5202RB; RoHS: Yes; Stock 1: 185; Pricing 1: 1=5.34000, 10=4.85100, 100=4.27430, 500=3.633; LCSC Part Number: N/A; Category: Headers and Wire Housings; Mount: Through Hole; Color: Black; Contact Material: Copper Alloy,Copper; Contact Plating: Gold; Housing Material: Polychlorinated; Min Operating Temperature: -55°C; Max Operating Temperature: 105°C; Packaging: Bulk; Number of Rows: 2; Termination: Solder; ComponentLink1URL: https://datasheet.ciiva.com/19461/1578947-194; ComponentLink1Description: https://datasheet.ciiva.com/19461/1578947-194; Package Quantity: 250; Series: 3000; Contact Type: Male Pin; Pitch: 2.54mm; Contact Mating Length: 0.24inch; RoHS Compliant: Yes; Number of Contacts: 26; REACH SVHC: No SVHC; Lead Free: Lead Free; ComponentLink2URL: https://datasheet.ciiva.com/11754/0900766b807; ComponentLink2Description: https://datasheet.ciiva.com/11754/0900766b807; ComponentLink3URL: https://datasheet.ciiva.com/719/ts0772-719341; ComponentLink3Description: https://datasheet.ciiva.com/719/ts0772-719341; ComponentLink4URL: https://datasheet.ciiva.com/8051/ts0772-80510; ComponentLink4Description: https://datasheet.ciiva.com/8051/ts0772-80510; Flammability Rating: UL94 V-0; Orientation: Right Angle; Length: 52.45mm; Depth: 24.6mm; Voltage: 300V; ComponentLink5URL: https://datasheet.ciiva.com/30156/eng-cs-1308; ComponentLink5Description: https://datasheet.ciiva.com/30156/eng-cs-1308; ComponentLink6URL: https://datasheet.ciiva.com/3141/eng-cs-13083; ComponentLink6Description: https://datasheet.ciiva.com/3141/eng-cs-13083; Housing Color: Black; Fastening Type: Latch; Max Voltage Rating (AC): 300V; Height: 8.6mm; Radiation Hardening: No; ELV: Compliant; ComponentLink7URL: https://datasheet.ciiva.com/823/eng-cd-284391; ComponentLink7Description: https://datasheet.ciiva.com/823/eng-cd-284391; Number of Circuits: 8; Wire Gauge (Min): 30AWG; Interlock: Yes (With); Max Supply Voltage (AC): 300V; Screw Flange: No (Without); Screwless Terminal Block: No (Without); Side Stackable: Yes (With)
R11-R16 R50 R51 R68 R69 = Res-00011: Res Thick Film 0402 51K Ohm 1% 0.063W(1/16W) ±100ppm/C Pad SMD Automotive T/R; Manufacturer: Stackpole Electronics; Manufacturer Part Number: RMCF0402FT51K0; Resistance: 51kR; Max Power Dissipation: 63mW; Temperature Coefficient: 100ppm/°C; Part Name: Res-00011; Supplier 1: Digi-Key; Supplier Part Number 1: RMCF0402FT51K0CT-ND; RoHS: Yes; Category: Chip SMD Resistors; Stock 1: 588931; Pricing 1: 1=0.10000, 10=0.01500, 100=0.00610, 1000=0.00; Case/Package: 0402; Case Code (Metric): 1005; Case Code (Imperial): 0402; Min Operating Temperature: -55°C; Max Operating Temperature: 155°C; Packaging: Tape and Reel; Resistor Type: Thick Film; Number of Terminations: 2; Tolerance: 1%; Features: Automotive AEC-Q200; Length: 0.039inch; Width: 0.02inch; Height: 0.016inch; RoHS Compliant: Yes; ComponentLink1URL: http://components.arrow.com/part/dataview/535; ComponentLink1Description: http://components.arrow.com/part/dataview/535; ComponentLink2URL: https://www.seielect.com/catalog/SEI-RMCF_RMC; ComponentLink2Description: https://www.seielect.com/catalog/SEI-RMCF_RMC; ComponentLink3URL: https://www.seielect.com/Catalog/SEI-RMCF_RMC; ComponentLink3Description: https://www.seielect.com/Catalog/SEI-RMCF_RMC; ComponentLink4URL: https://www.seielect.com/catalog/SEI-Packagin; ComponentLink4Description: https://www.seielect.com/catalog/SEI-Packagin; LCSC Part Number: C25794; Mount: Surface Mount; Contact Plating: Tin,Matte; Power Rating: 63mW; Series: RMCF; Radiation Hardening: No
R17 R21 R111 R112 = Res-00008: Thick Film 0402 2.8K Ohm 1% 0.063W ±100ppm/°C Molded SMD Paper T/R; Manufacturer: Stackpole Electronics; Manufacturer Part Number: RMCF0402FT2K80; Resistance: 2.8kR; Max Power Dissipation: 63mW; Power Rating: 62.5mW; Part Name: Res-00008; Supplier 1: Digi-Key; Supplier Part Number 1: RMCF0402FT2K80CT-ND; RoHS: Yes; Category: Chip SMD Resistors; Stock 1: 141882; Pricing 1: 1=0.10000, 10=0.01500, 100=0.00610, 1000=0.00; Case/Package: 0402; Case Code (Metric): 1005; Case Code (Imperial): 0402; Min Operating Temperature: -55°C; Max Operating Temperature: 155°C; Packaging: Tape and Reel; Resistor Type: Thick Film; Number of Terminations: 2; Tolerance: 1%; Temperature Coefficient: 100ppm/°C; Features: Automotive AEC-Q200; Length: 0.039inch; Width: 0.02inch; Height: 0.016inch; RoHS Compliant: Yes; ComponentLink1URL: https://www.seielect.com/catalog/SEI-RMCF_RMC; ComponentLink1Description: https://www.seielect.com/catalog/SEI-RMCF_RMC; ComponentLink2URL: https://www.seielect.com/Catalog/SEI-RMCF_RMC; ComponentLink2Description: https://www.seielect.com/Catalog/SEI-RMCF_RMC; ComponentLink3URL: https://www.seielect.com/catalog/SEI-Packagin; ComponentLink3Description: https://www.seielect.com/catalog/SEI-Packagin; LCSC Part Number: C62741; Mount: Surface Mount; Contact Plating: Tin,Matte; Series: RMCF; Radiation Hardening: No; Lead Free: Lead Free
R18-R20 = Res-00012: Res Thick Film 0402 8.2K Ohm 5% 0.063W ±100ppm/°C Molded SMD Paper T/R; Manufacturer: Stackpole Electronics; Manufacturer Part Number: RMCF0402JT8K20; Resistance: 8.2kR; Max Power Dissipation: 63mW; Part Name: Res-00012; Supplier 1: Digi-Key; Supplier Part Number 1: 738-RMCF0402JT8K20CT-ND; RoHS: Yes; Category: Chip SMD Resistors; Stock 1: 9938; Pricing 1: 1=0.10000, 10=0.01200, 100=0.00470, 1000=0.00; Case/Package: 0402; Case Code (Metric): 1005; Case Code (Imperial): 0402; Min Operating Temperature: -55°C; Max Operating Temperature: 155°C; Packaging: Tape and Reel; Resistor Type: Thick Film; Number of Terminations: 2; Tolerance: 5%; Temperature Coefficient: 100ppm/°C; Features: Automotive AEC-Q200; Length: 0.039inch; Width: 0.02inch; Height: 0.016inch; RoHS Compliant: Yes; ComponentLink1URL: https://www.seielect.com/Catalog/SEI-RMCF_RMC; ComponentLink1Description: https://www.seielect.com/Catalog/SEI-RMCF_RMC; ComponentLink2URL: https://www.seielect.com/catalog/sei-rmcf_rmc; ComponentLink2Description: https://www.seielect.com/catalog/sei-rmcf_rmc; ComponentLink3URL: https://www.seielect.com/catalog/SEI-RMCF_RMC; ComponentLink3Description: https://www.seielect.com/catalog/SEI-RMCF_RMC; ComponentLink4URL: http://www.seielect.com/Catalog/Sei-RMC.pdf?s; ComponentLink4Description: http://www.seielect.com/Catalog/Sei-RMC.pdf?s; LCSC Part Number: C25924; Mount: Surface Mount; Contact Plating: Tin,Matte; Power Rating: 63mW; Series: RMCF; Radiation Hardening: No; Size Code: 0402; Lead Free: Lead Free
R22-R49 R118 R119 = Res-00002: as R2 on sheet Teensy; Part Name: Res-00002; Supplier 1: Digi-Key; Supplier Part Number 1: YAG1249CT-ND; RoHS: Yes; Category: Chip SMD Resistors; Stock 1: 161500; Pricing 1: 1=0.10000, 10=0.03600, 100=0.01450, 1000=0.00; Case/Package: 0402; Case Code (Metric): 1005; Case Code (Imperial): 0402; Min Operating Temperature: -55°C; Max Operating Temperature: 155°C; Packaging: Tape and Reel; Resistance: 10k; Resistor Type: Thick Film; Number of Terminations: 2; Tolerance: 1%; Features: Moisture Resistant; Length: 0.039inch; Width: 0.02inch; Height: 0.016inch; RoHS Compliant: Yes; ComponentLink1URL: http://www.yageo.com/NewPortal/yageodocoutput; ComponentLink1Description: http://www.yageo.com/NewPortal/yageodocoutput; LCSC Part Number: C25744; Mount: Surface Mount
U3 U7-U10 = Diode-0012: TVS DIODE 5.5VWM SOT6; Manufacturer: Texas Instruments; Capacitance: 1.5pF; Max Power Dissipation: 100W; Breakdown Voltage: 11V; Direction: Unidirectional; Reverse Standoff Voltage: 5.5V; Clamping Voltage: 105.5V; Power Line Protection: Yes; Number of Channels: 4; Leakage Current: 1nA; Peak Pulse Current: 5.5A; Interface: LVDS,USB,Ethernet; Part Name: Diode-0012; Supplier 1: Digi-Key; Supplier Part Number 1: 296-21887-1-ND; Manufacturer Part Number: TPD4E001DRLR; RoHS: Yes; Category: ESD and Circuit Protection ICs; Stock 1: 42388; Pricing 1: 1=0.66000, 10=0.58100, 100=0.44520, 500=0.351; Mount: Surface Mount; Case/Package: SOT; Packaging: Tape and Reel; RoHS Compliant: Yes; ComponentLink1URL: https://datasheet.ciiva.com/5839/1535398-5839; ComponentLink1Description: https://datasheet.ciiva.com/5839/1535398-5839; ComponentLink2URL: https://datasheet.ciiva.com/22696/1831342-226; ComponentLink2Description: https://datasheet.ciiva.com/22696/1831342-226; ComponentLink3URL: https://datasheet.ciiva.com/1219/tpd4e001-121; ComponentLink3Description: https://datasheet.ciiva.com/1219/tpd4e001-121; Number of Pins: 6; Min Operating Temperature: -40°C; Max Operating Temperature: 85°C; Package Quantity: 1; Series: -; Radiation Hardening: No; Lead Free: Lead Free; ComponentLink4URL: https://datasheet.ciiva.com/15134/getdatashee; ComponentLink4Description: https://datasheet.ciiva.com/15134/getdatashee; ComponentLink5URL: https://datasheet.ciiva.com/7659/1853592-7659; ComponentLink5Description: https://datasheet.ciiva.com/7659/1853592-7659; ComponentLink6URL: https://datasheet.ciiva.com/338/tpd4e001-3380; ComponentLink6Description: https://datasheet.ciiva.com/338/tpd4e001-3380; ComponentLink7URL: https://datasheet.ciiva.com/338/tpd4e001-3380; ComponentLink7Description: https://datasheet.ciiva.com/338/tpd4e001-3380; ComponentLink8URL: https://datasheet.ciiva.com/338/tpd4e001-3380; ComponentLink8Description: https://datasheet.ciiva.com/338/tpd4e001-3380; LCSC Part Number: C527516; Length: 1.6mm; Depth: 1.2mm; Width: 1.2mm; Height: 0.55mm; Contact Plating: Gold; Weight: 9.9E-05oz; Termination: SMD/SMT; REACH SVHC: No SVHC; Min Breakdown Voltage: 11V; Peak Pulse Power: 100W; Polarity: Unidirectional; Working Voltage: 5.5V; Max Breakdown Voltage: 11V; Operating Supply Voltage: 5.5V; Number of Bidirectional Channels: 4; ComponentLink9URL: https://datasheet.ciiva.com/14423/tpd4e001-14; ComponentLink9Description: https://datasheet.ciiva.com/14423/tpd4e001-14
U5 U6 = AIC-0001: 5-V, 8: 1, 1-channel analog mutliplexer 16-TS; Manufacturer: Texas Instruments; VCC(Max)(V): 6; Ron(Typ)(Ohms): 45; Rating: Catalog; VCC(Min)(V): 2; Ron(Max)(Ohms): 130; Configuration: 1 X 1：8 MUX; Crosstalk: Yes; Bandwidth(Max)(MHz): 180; Bandwidth: 180MHz; Propagation Delay: 60ns; Number of Outputs: 1; Max Supply Voltage: 6V; Min Supply Voltage: 2V; Number of Inputs: 8; Min Dual Supply Voltage: 1V; Max Dual Supply Voltage: 5V; Dual Supply Voltage: 3V; Logic Function: Multiplexer,Demultiplexer; On-State Resistance: 130R; Turn-On Delay Time: 225ns; Supply Type: Single,Dual; Nominal Supply Current: 16uA; Polarity: Non-Inverting; Low Level Output Current: 25mA; PackageVersion: http://www.ti.com/lit/ml/mpds178g/mpds178g.pdf; Generic Part Number: CD74HC4051; PackageReference: D0016A; Operating Temperature Range(C): -55 to 125; DatasheetVersion: SCHS122J; Code_JEDEC: MS-012 variation AC; Manufacturer Part Number: CD74HC4051PWR; Part Name: AIC-0001; LCSC Part Number: C352826; Supplier 1: Newark; Supplier Part Number 1: 29AH3620; RoHS: Yes; Category: Decoders and Multiplexers; Stock 1: 12645; Pricing 1: 1=0.33420, 10=0.26780, 30=0.23940, 100=0.2039; Mount: Surface Mount; Case/Package: TSSOP; Number of Pins: 16; Weight: 0.002183oz; Contact Plating: Gold; Min Operating Temperature: -55°C; Max Operating Temperature: 125°C; Package Quantity: 1; Packaging: Tape and Reel; Number of Channels: 1; Turn-Off Delay Time: 225ns; Number of Bits: 8; Series: 74HC; Number of Circuits: 1; High Level Output Current: 25mA; Number of Switches: 1; Max Output Current: 25mA; Termination: SMD/SMT; Supply Current: 16uA; Length: 5mm; Width: 4.4mm; Height: 1.15mm; Radiation Hardening: No; Lead Free: Lead Free; RoHS Compliant: Yes; REACH SVHC: No SVHC; ComponentLink1URL: https://datasheet.ciiva.com/15127/getdatashee; ComponentLink1Description: https://datasheet.ciiva.com/15127/getdatashee; ComponentLink2URL: https://datasheet.ciiva.com/27092/1326571-270; ComponentLink2Description: https://datasheet.ciiva.com/27092/1326571-270; ComponentLink3URL: https://datasheet.ciiva.com/1514/1789854-1514; ComponentLink3Description: https://datasheet.ciiva.com/1514/1789854-1514; ComponentLink4URL: https://datasheet.ciiva.com/1171/1633734-1171; ComponentLink4Description: https://datasheet.ciiva.com/1171/1633734-1171; ComponentLink5URL: https://datasheet.ciiva.com/1171/1633734-1171; ComponentLink5Description: https://datasheet.ciiva.com/1171/1633734-1171; ComponentLink6URL: https://datasheet.ciiva.com/2978/cd74hct4053-; ComponentLink6Description: https://datasheet.ciiva.com/2978/cd74hct4053-; ComponentLink7URL: https://datasheet.ciiva.com/46391/1840262-463; ComponentLink7Description: https://datasheet.ciiva.com/46391/1840262-463